# Altium schematic sheet CONNECTOR.SchDoc
size 420 x 297 mm; SheetNumber: 2; SheetTotal: 4
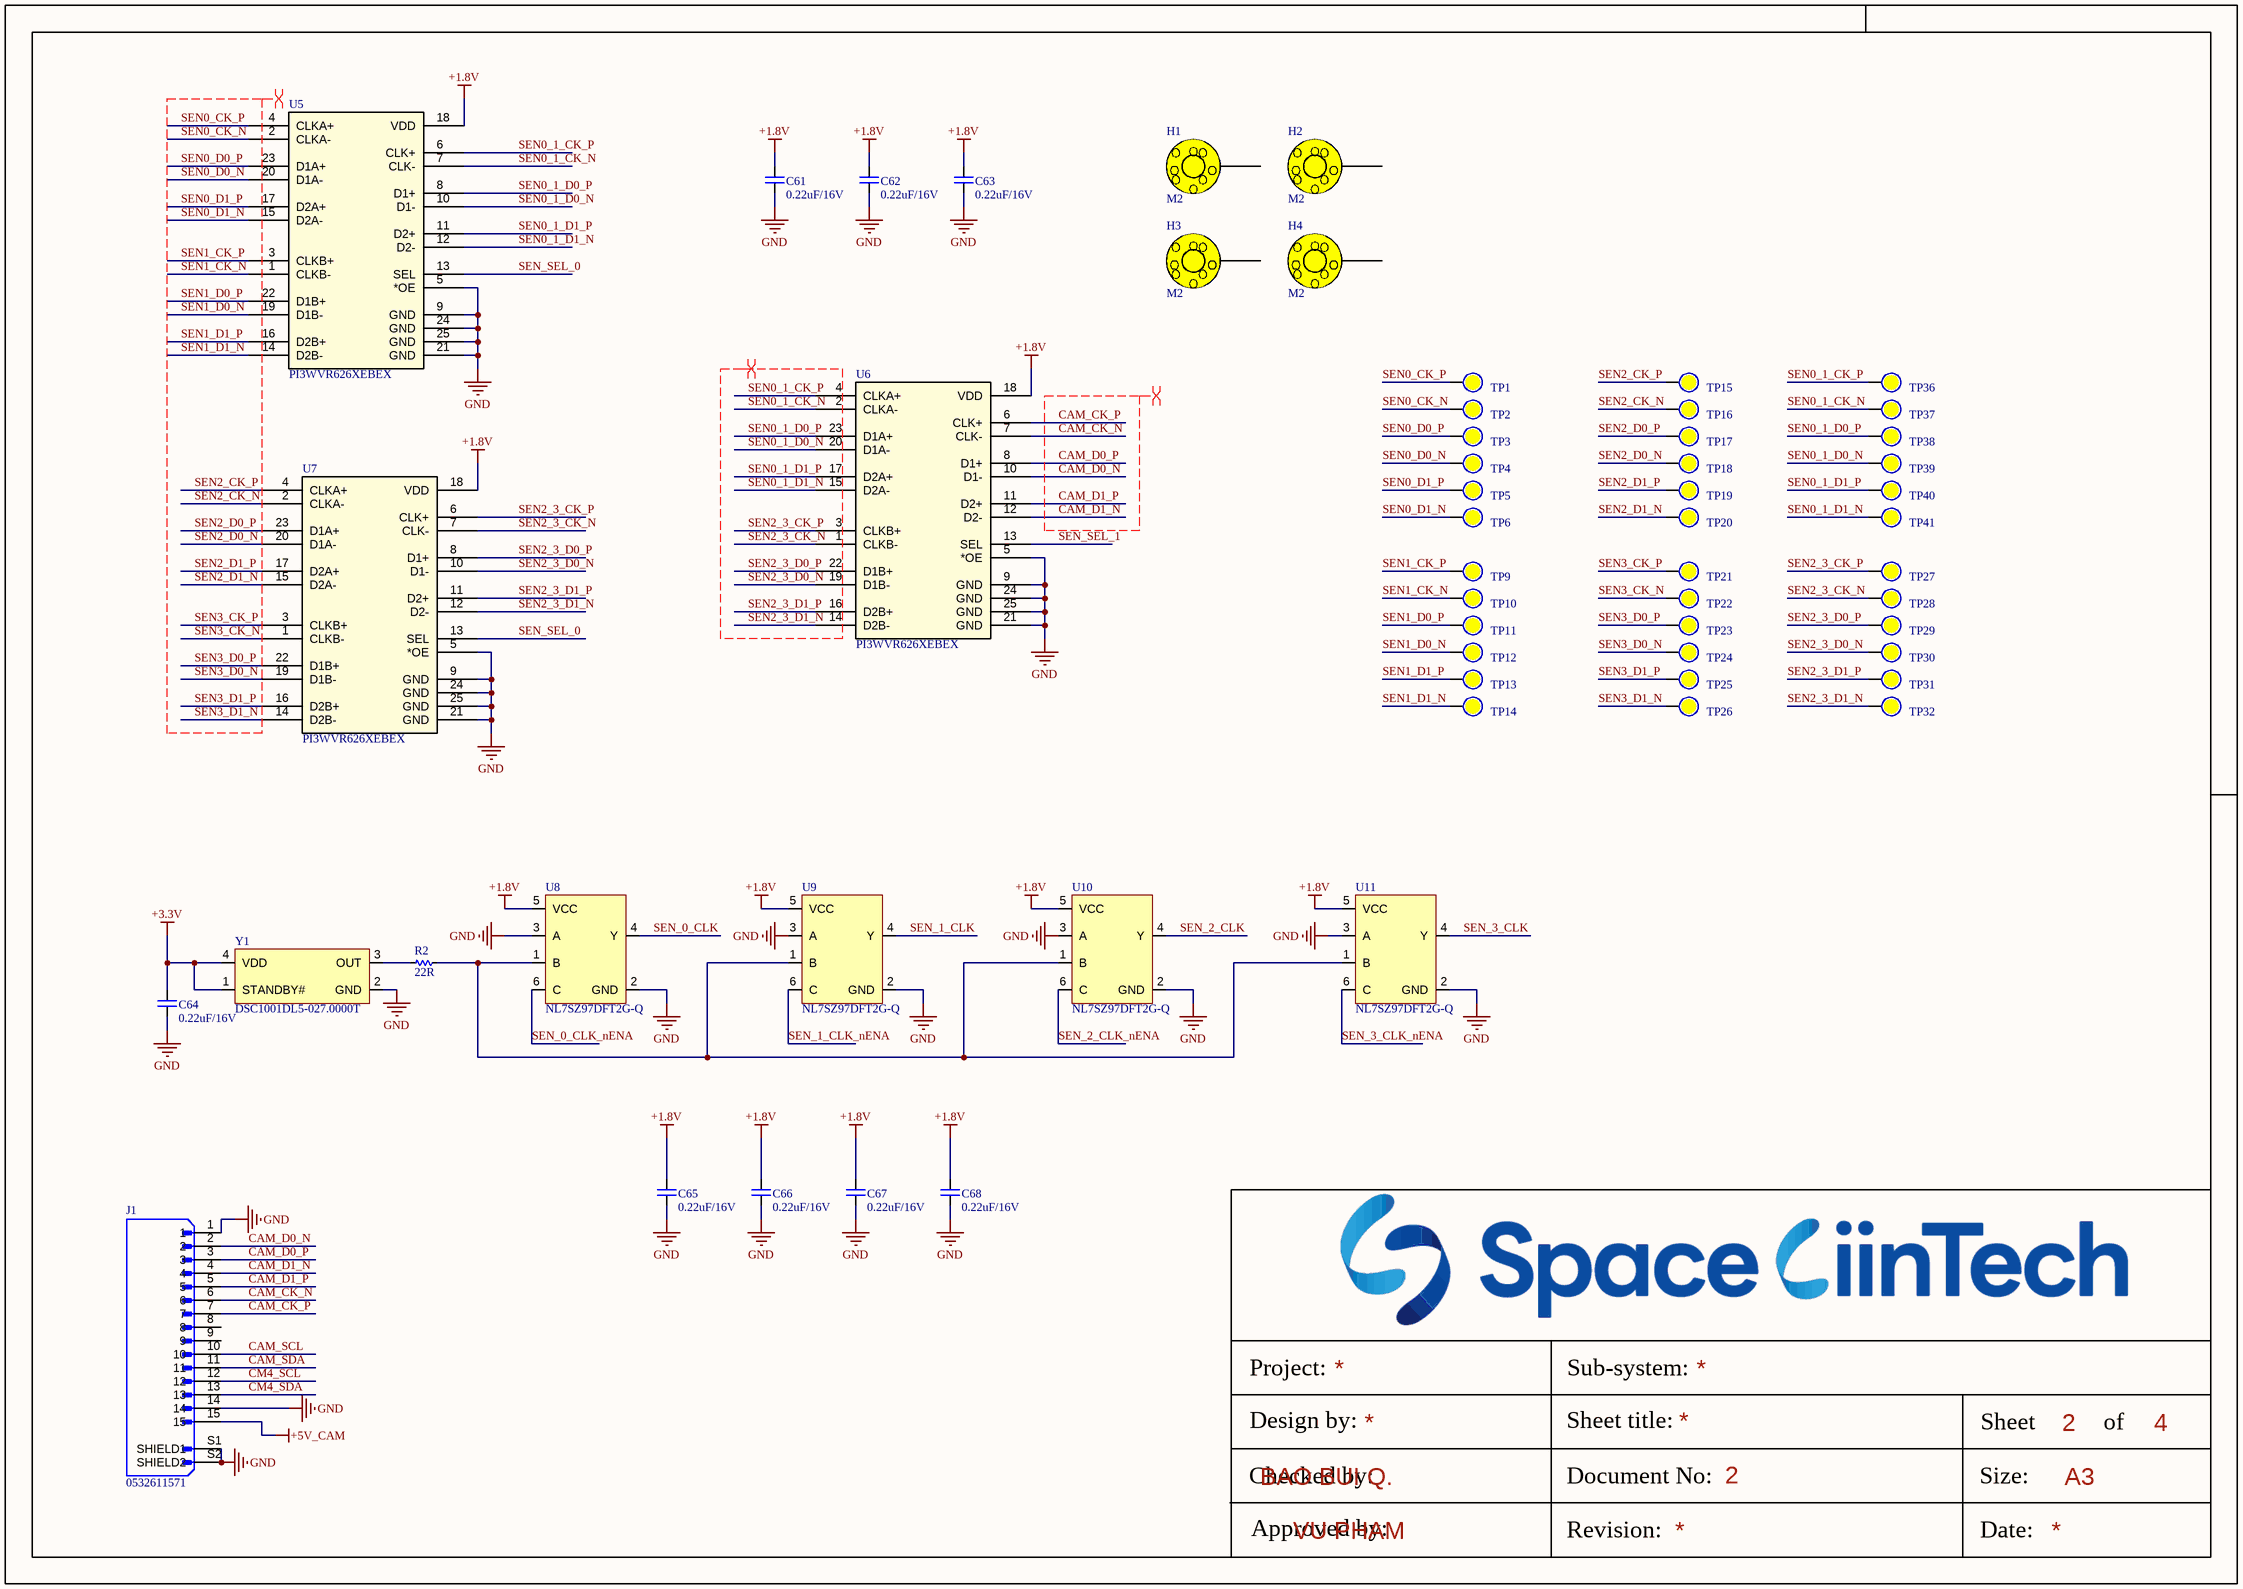
[diagram p0: CONNECTOR.SchDoc]

## Parts
C61  0.22uF/16V  [CAP_C_1005X60]
C62  0.22uF/16V  [CAP_C_1005X60]
C63  0.22uF/16V  [CAP_C_1005X60]
C64  0.22uF/16V  [CAP_C_1005X60]
C65  0.22uF/16V  [CAP_C_1005X60]
C66  0.22uF/16V  [CAP_C_1005X60]
C67  0.22uF/16V  [CAP_C_1005X60]
C68  0.22uF/16V  [CAP_C_1005X60]
H1  M2  [HEX-2.2mm]
H2  M2  [HEX-2.2mm]
H3  M2  [HEX-2.2mm]
H4  M2  [HEX-2.2mm]
J1  0532611571  [0532611571]
R2  22R  [RES_C_1005X40]
TP1  (no value)  [Testpoint_60]  (no BOM)
TP2  (no value)  [Testpoint_60]  (no BOM)
TP3  (no value)  [Testpoint_60]  (no BOM)
TP4  (no value)  [Testpoint_60]  (no BOM)
TP5  (no value)  [Testpoint_60]  (no BOM)
TP6  (no value)  [Testpoint_60]  (no BOM)
TP9  (no value)  [Testpoint_60]  (no BOM)
TP10  (no value)  [Testpoint_60]  (no BOM)
TP11  (no value)  [Testpoint_60]  (no BOM)
TP12  (no value)  [Testpoint_60]  (no BOM)
TP13  (no value)  [Testpoint_60]  (no BOM)
TP14  (no value)  [Testpoint_60]  (no BOM)
TP15  (no value)  [Testpoint_60]  (no BOM)
TP16  (no value)  [Testpoint_60]  (no BOM)
TP17  (no value)  [Testpoint_60]  (no BOM)
TP18  (no value)  [Testpoint_60]  (no BOM)
TP19  (no value)  [Testpoint_60]  (no BOM)
TP20  (no value)  [Testpoint_60]  (no BOM)
TP21  (no value)  [Testpoint_60]  (no BOM)
TP22  (no value)  [Testpoint_60]  (no BOM)
TP23  (no value)  [Testpoint_60]  (no BOM)
TP24  (no value)  [Testpoint_60]  (no BOM)
TP25  (no value)  [Testpoint_60]  (no BOM)
TP26  (no value)  [Testpoint_60]  (no BOM)
TP27  (no value)  [Testpoint_50]  (no BOM)
TP28  (no value)  [Testpoint_50]  (no BOM)
TP29  (no value)  [Testpoint_50]  (no BOM)
TP30  (no value)  [Testpoint_50]  (no BOM)
TP31  (no value)  [Testpoint_50]  (no BOM)
TP32  (no value)  [Testpoint_50]  (no BOM)
TP36  (no value)  [Testpoint_50]  (no BOM)
TP37  (no value)  [Testpoint_50]  (no BOM)
TP38  (no value)  [Testpoint_50]  (no BOM)
TP39  (no value)  [Testpoint_50]  (no BOM)
TP40  (no value)  [Testpoint_50]  (no BOM)
TP41  (no value)  [Testpoint_50]  (no BOM)
U5  PI3WVR626XEBEX  [PI3WVR626XEBEX_DIO_2]
U6  PI3WVR626XEBEX  [PI3WVR626XEBEX_DIO_2]
U7  PI3WVR626XEBEX  [PI3WVR626XEBEX_DIO_2]
U8  NL7SZ97DFT2G-Q  [SC-88]
U9  NL7SZ97DFT2G-Q  [SC-88]
U10  NL7SZ97DFT2G-Q  [SC-88]
U11  NL7SZ97DFT2G-Q  [SC-88]
Y1  DSC1001DL5-027.0000T  [OSCDFN250X200X89-4N]

## Nets
+1.8V: C61.2 C62.2 C63.2 C65.2 C66.2 C67.2 C68.2 U5.18(VDD) U6.18(VDD) U7.18(VDD) U8.5(VCC) U9.5(VCC) U10.5(VCC) U11.5(VCC)
+3.3V: C64.2 Y1.1(STANDBY#) Y1.4(VDD)
+5V_CAM: J1.15
GND: C61.1 C62.1 C63.1 C64.1 C65.1 C66.1 C67.1 C68.1 J1.1 J1.14 J1.S1(SHIELD1) J1.S2(SHIELD2) U5.5(*OE) U5.9(GND) U5.21(GND) U5.24(GND) U5.25(GND) U6.5(*OE) U6.9(GND) U6.21(GND) U6.24(GND) U6.25(GND) U7.5(*OE) U7.9(GND) U7.21(GND) U7.24(GND) U7.25(GND) U8.2(GND) U8.3(A) U9.2(GND) U9.3(A) U10.2(GND) U10.3(A) U11.2(GND) U11.3(A) Y1.2(GND)
CAM_CK_N: J1.6 U6.7(CLK-)
CAM_CK_P: J1.7 U6.6(CLK+)
CAM_D0_N: J1.2 U6.10(D1-)
CAM_D0_P: J1.3 U6.8(D1+)
CAM_D1_N: J1.4 U6.12(D2-)
CAM_D1_P: J1.5 U6.11(D2+)
CAM_SCL: J1.10
CAM_SDA: J1.11
CM4_SCL: J1.12
CM4_SDA: J1.13
SEN0_1_CK_N: TP37.0 U5.7(CLK-) U6.2(CLKA-)
SEN0_1_CK_P: TP36.0 U5.6(CLK+) U6.4(CLKA+)
SEN0_1_D0_N: TP39.0 U5.10(D1-) U6.20(D1A-)
SEN0_1_D0_P: TP38.0 U5.8(D1+) U6.23(D1A+)
SEN0_1_D1_N: TP41.0 U5.12(D2-) U6.15(D2A-)
SEN0_1_D1_P: TP40.0 U5.11(D2+) U6.17(D2A+)
SEN0_CK_N: TP2.0 U5.2(CLKA-)
SEN0_CK_P: TP1.0 U5.4(CLKA+)
SEN0_D0_N: TP4.0 U5.20(D1A-)
SEN0_D0_P: TP3.0 U5.23(D1A+)
SEN0_D1_N: TP6.0 U5.15(D2A-)
SEN0_D1_P: TP5.0 U5.17(D2A+)
SEN1_CK_N: TP10.0 U5.1(CLKB-)
SEN1_CK_P: TP9.0 U5.3(CLKB+)
SEN1_D0_N: TP12.0 U5.19(D1B-)
SEN1_D0_P: TP11.0 U5.22(D1B+)
SEN1_D1_N: TP14.0 U5.14(D2B-)
SEN1_D1_P: TP13.0 U5.16(D2B+)
SEN2_3_CK_N: TP28.0 U6.1(CLKB-) U7.7(CLK-)
SEN2_3_CK_P: TP27.0 U6.3(CLKB+) U7.6(CLK+)
SEN2_3_D0_N: TP30.0 U6.19(D1B-) U7.10(D1-)
SEN2_3_D0_P: TP29.0 U6.22(D1B+) U7.8(D1+)
SEN2_3_D1_N: TP32.0 U6.14(D2B-) U7.12(D2-)
SEN2_3_D1_P: TP31.0 U6.16(D2B+) U7.11(D2+)
SEN2_CK_N: TP16.0 U7.2(CLKA-)
SEN2_CK_P: TP15.0 U7.4(CLKA+)
SEN2_D0_N: TP18.0 U7.20(D1A-)
SEN2_D0_P: TP17.0 U7.23(D1A+)
SEN2_D1_N: TP20.0 U7.15(D2A-)
SEN2_D1_P: TP19.0 U7.17(D2A+)
SEN3_CK_N: TP22.0 U7.1(CLKB-)
SEN3_CK_P: TP21.0 U7.3(CLKB+)
SEN3_D0_N: TP24.0 U7.19(D1B-)
SEN3_D0_P: TP23.0 U7.22(D1B+)
SEN3_D1_N: TP26.0 U7.14(D2B-)
SEN3_D1_P: TP25.0 U7.16(D2B+)
SEN_0_CLK: U8.4(Y)
SEN_0_CLK_nENA: U8.6(C)
SEN_1_CLK: U9.4(Y)
SEN_1_CLK_nENA: U9.6(C)
SEN_2_CLK: U10.4(Y)
SEN_2_CLK_nENA: U10.6(C)
SEN_3_CLK: U11.4(Y)
SEN_3_CLK_nENA: U11.6(C)
SEN_SEL_0: U5.13(SEL) U7.13(SEL)
SEN_SEL_1: U6.13(SEL)
NetR2_1: R2.1 U8.1(B) U9.1(B) U10.1(B) U11.1(B)
NetR2_2: R2.2 Y1.3(OUT)

Not connected (* = marked no-connect by the designer): H1 1; H2 1; H3 1; H4 1; J1 8 9

## Layout directives
differential pair; net class DIFF100; differential pair class DIFF100: CAM_CK_N, CAM_CK_P, CAM_D0_N, CAM_D0_P, CAM_D1_N, CAM_D1_P, SEN0_1_CK_N, SEN0_1_CK_P, SEN0_1_D0_N, SEN0_1_D0_P, SEN0_1_D1_N, SEN0_1_D1_P, SEN0_CK_N, SEN0_CK_P, SEN0_D0_N, SEN0_D0_P, SEN0_D1_N, SEN0_D1_P, SEN1_CK_N, SEN1_CK_P, SEN1_D0_N, SEN1_D0_P, SEN1_D1_N, SEN1_D1_P, SEN2_3_CK_N, SEN2_3_CK_P, SEN2_3_D0_N, SEN2_3_D0_P, SEN2_3_D1_N, SEN2_3_D1_P, SEN2_CK_N, SEN2_CK_P, SEN2_D0_N, SEN2_D0_P, SEN2_D1_N, SEN2_D1_P, SEN3_CK_N, SEN3_CK_P, SEN3_D0_N, SEN3_D0_P, SEN3_D1_N, SEN3_D1_P

## Notes on the sheet
- Project:
- Sub-system:
- Design by:
- BAO BUI Q.
- Sheet title:
- Sheet
- A3
- of
- Checked by:
- Approved by:
- VU PHAM
- Revision:
- Document No:
- Size:
- Date:

## Library data of the parts
C61-C68 = CAP_SMD: CAP_Chip; Value: 33pF
H1-H4 = HEX-M3
J1 = CONN_SMD_15: Conn Shrouded Header (4 Sides) HDR 15 POS 1.25mm Solder RA Side Entry SMD PicoBladeâ„¢ T/R; MF: Molex; Package: None; MP: 532611571; Check_prices: https://www.snapeda.com/parts/532611571/Molex/view-part/?ref=eda; Purchase-URL: https://pricing.snapeda.com/search/part/532611571/?ref=eda; Value: *; Availability: In Stock; Price: None; SnapEDA_Link: https://www.snapeda.com/parts/532611571/Molex/view-part/?ref=snap
R2 = RES-SMD: RES-Chip; Manufacturer: Generic Components; Class: Passive; Published: 08/06/2000; Publisher: Altium Hobart Technology Centre
TP1-TP6 TP9-TP32 TP36-TP41 = Test Point: Solder: NF
U5-U7 = PI3WVR626XEBEX: Mfr_Name: Diodes Inc; RefDes: RefDes; Type: Type
U8-U11 = IC_FLEXLOGIC_NL7SZ97DFT2G-Q
Y1 = Y_OSC27MHz_DSC1001DL5-027.0000T